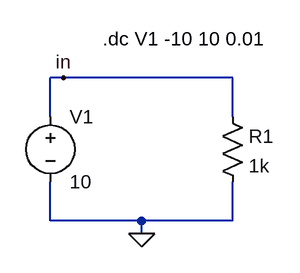
[diagram p0: schematic ideal_resistor_iv.asc]
ideal_resistor_iv.asc, the LTspice schematic file:
Version 4.1
SHEET 1 968 680
WIRE 704 144 688 144
WIRE 912 144 704 144
WIRE 688 192 688 144
WIRE 912 192 912 144
WIRE 688 320 688 272
WIRE 800 320 688 320
WIRE 912 320 912 272
WIRE 912 320 800 320
WIRE 800 336 800 320
FLAG 800 336 0
FLAG 704 144 in
SYMBOL voltage 688 176 R0
WINDOW 123 0 0 Left 0
WINDOW 39 0 0 Left 0
SYMATTR InstName V1
SYMATTR Value 10
SYMBOL res 896 176 R0
SYMATTR InstName R1
SYMATTR Value 1k
TEXT 752 96 Left 2 !.dc V1 -10 10 0.01

The netlist it stands for:
* ideal_resistor_iv.asc
V1 in 0 10
R1 in 0 1k
.dc V1 -10 10 0.01
.backanno
.end